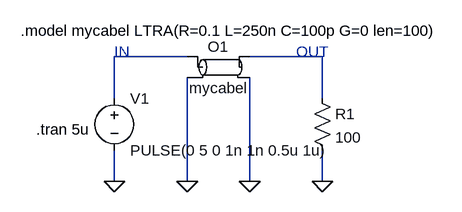
[diagram p0: schematic Q3 Signal Transmission through Wired Media match mismatch.asc]
Q3 Signal Transmission through Wired Media match mismatch.asc, the LTspice schematic file:
Version 4
SHEET 1 880 680
WIRE 176 48 64 48
WIRE 384 48 272 48
WIRE 64 112 64 48
WIRE 384 112 384 48
WIRE 64 240 64 192
WIRE 176 240 176 80
WIRE 272 240 272 80
WIRE 384 240 384 192
FLAG 64 240 0
FLAG 176 240 0
FLAG 272 240 0
FLAG 384 240 0
SYMBOL voltage 64 96 R0
WINDOW 123 0 0 Left 0
WINDOW 39 0 0 Left 0
SYMATTR InstName V1
SYMATTR Value PULSE(0 5 0 1n 1n 0.5u 1u)
SYMBOL res 368 96 R0
SYMATTR InstName R1
SYMATTR Value 100
SYMBOL ltline 224 64 R0
SYMATTR InstName O1
SYMATTR Value mycabel
TEXT -80 8 Left 2 !.model mycabel LTRA(R=0.1 L=250n C=100p G=0 len=100)
TEXT 64 40 Left 2 ;IN
TEXT 344 40 Left 2 ;OUT
TEXT -56 160 Left 2 !.tran 5u

The netlist it stands for:
* Q3 Signal Transmission through Wired Media match mismatch.asc
V1 N001 0 PULSE(0 5 0 1n 1n 0.5u 1u)
R1 N002 0 100
O1 N001 0 N002 0 mycabel
.model mycabel LTRA(R=0.1 L=250n C=100p G=0 len=100)
* IN
* OUT
.tran 5u
.backanno
.end